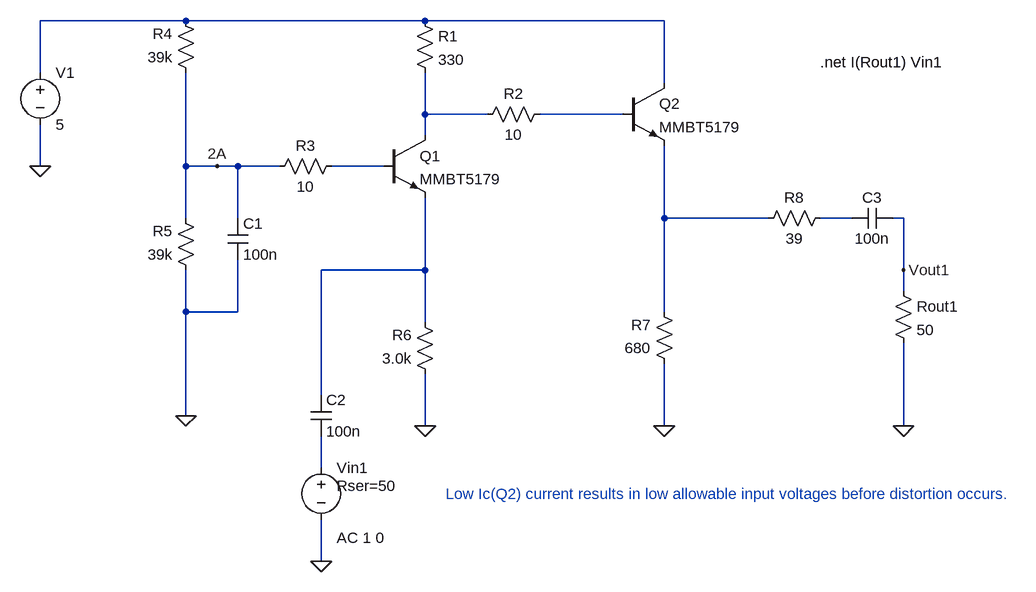
[diagram p0: schematic TIA_too_low_Ic.asc]
TIA_too_low_Ic.asc, the LTspice schematic file:
Version 4
SHEET 1 880 680
WIRE -752 -864 -976 -864
WIRE -384 -864 -752 -864
WIRE -16 -864 -384 -864
WIRE -976 -784 -976 -864
WIRE -16 -768 -16 -864
WIRE -384 -720 -384 -784
WIRE -288 -720 -384 -720
WIRE -80 -720 -208 -720
WIRE -384 -688 -384 -720
WIRE -976 -640 -976 -704
WIRE -752 -640 -752 -784
WIRE -704 -640 -752 -640
WIRE -672 -640 -704 -640
WIRE -608 -640 -672 -640
WIRE -448 -640 -528 -640
WIRE -752 -560 -752 -640
WIRE -672 -560 -672 -640
WIRE -16 -560 -16 -672
WIRE 144 -560 -16 -560
WIRE 272 -560 224 -560
WIRE 352 -560 336 -560
WIRE -384 -480 -384 -592
WIRE -384 -480 -544 -480
WIRE 352 -480 352 -560
WIRE 352 -448 352 -480
WIRE -752 -416 -752 -480
WIRE -672 -416 -672 -496
WIRE -672 -416 -752 -416
WIRE -16 -416 -16 -560
WIRE -384 -400 -384 -480
WIRE -544 -288 -544 -480
WIRE -752 -256 -752 -416
WIRE -384 -240 -384 -320
WIRE -16 -240 -16 -336
WIRE 352 -240 352 -368
WIRE -544 -176 -544 -224
WIRE -544 -32 -544 -96
FLAG -976 -640 0
FLAG -752 -256 0
FLAG -384 -240 0
FLAG -16 -240 0
FLAG 352 -240 0
FLAG -544 -32 0
FLAG -704 -640 2A
FLAG 352 -480 Vout1
SYMBOL npn -448 -688 R0
SYMATTR InstName Q1
SYMATTR Value MMBT5179
SYMBOL npn -80 -768 R0
SYMATTR InstName Q2
SYMATTR Value MMBT5179
SYMBOL res -400 -880 R0
SYMATTR InstName R1
SYMATTR Value 330
SYMBOL res -192 -736 R90
WINDOW 0 0 56 VBottom 2
WINDOW 3 32 56 VTop 2
SYMATTR InstName R2
SYMATTR Value 10
SYMBOL res -512 -656 R90
WINDOW 0 0 56 VBottom 2
WINDOW 3 32 56 VTop 2
SYMATTR InstName R3
SYMATTR Value 10
SYMBOL res -736 -768 R180
WINDOW 0 36 76 Left 2
WINDOW 3 36 40 Left 2
SYMATTR InstName R4
SYMATTR Value 39k
SYMBOL res -736 -464 R180
WINDOW 0 36 76 Left 2
WINDOW 3 36 40 Left 2
SYMATTR InstName R5
SYMATTR Value 39k
SYMBOL res -368 -304 R180
WINDOW 0 36 76 Left 2
WINDOW 3 36 40 Left 2
SYMATTR InstName R6
SYMATTR Value 3.0k
SYMBOL res 0 -320 R180
WINDOW 0 36 76 Left 2
WINDOW 3 36 40 Left 2
SYMATTR InstName R7
SYMATTR Value 680
SYMBOL res 128 -544 R270
WINDOW 0 32 56 VTop 2
WINDOW 3 0 56 VBottom 2
SYMATTR InstName R8
SYMATTR Value 39
SYMBOL voltage -976 -800 R0
WINDOW 123 0 0 Left 0
WINDOW 39 0 0 Left 0
SYMATTR InstName V1
SYMATTR Value 5
SYMBOL cap -688 -560 R0
SYMATTR InstName C1
SYMATTR Value 100n
SYMBOL cap -560 -288 R0
SYMATTR InstName C2
SYMATTR Value 100n
SYMBOL cap 336 -576 R90
WINDOW 0 0 32 VBottom 2
WINDOW 3 32 32 VTop 2
SYMATTR InstName C3
SYMATTR Value 100n
SYMBOL res 336 -464 R0
SYMATTR InstName Rout1
SYMATTR Value 50
SYMBOL voltage -544 -192 R0
WINDOW 3 24 96 Invisible 2
WINDOW 123 24 124 Left 2
WINDOW 39 24 44 Left 2
SYMATTR Value SINE(0 70e-3 10.7e6)
SYMATTR Value2 AC 1 0
SYMATTR SpiceLine Rser=50
SYMATTR InstName Vin1
TEXT 224 -800 Left 2 !.net I(Rout1) Vin1
TEXT -352 -136 Left 2 ;Low Ic(Q2) current results in low allowable input voltages before distortion occurs.

The netlist it stands for:
* TIA_too_low_Ic.asc
Q1 N002 N004 N007 0 MMBT5179
Q2 N001 N003 N005 0 MMBT5179
R1 N001 N002 330
R2 N003 N002 10
R3 N004 2A 10
R4 2A N001 39k
R5 0 2A 39k
R6 0 N007 3.0k
R7 0 N005 680
R8 N005 N006 39
V1 N001 0 5
C1 2A 0 100n
C2 N007 N008 100n
C3 Vout1 N006 100n
Rout1 Vout1 0 50
Vin1 N008 0 SINE(0 70e-3 10.7e6) AC 1 0 Rser=50
.model NPN NPN
.model PNP PNP
.lib standard.bjt
.net I(Rout1) Vin1
* Low Ic(Q2) current results in low allowable input voltages before distortion occurs.
.backanno
.end